# Altium schematic sheet Temperature_sensor.SchDoc
size A
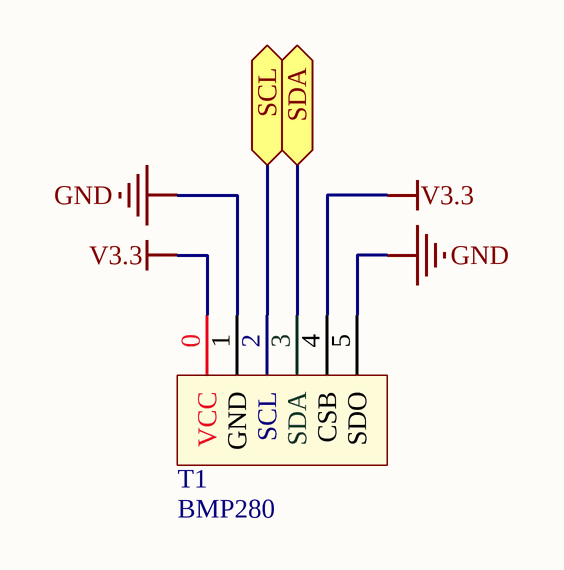
[diagram p0: Temperature_sensor.SchDoc]

## Parts
T1  BMP280

## Ports
SCL (bidir), SDA (bidir)

## Nets
GND: T1.1(GND) T1.5(SDO)
V3.3: T1.0(VCC) T1.4(CSB)
SCL: T1.2(SCL) ; port SCL
SDA: T1.3(SDA) ; port SDA

## Library data of the parts
T1 = BMP280: I2C thermometer